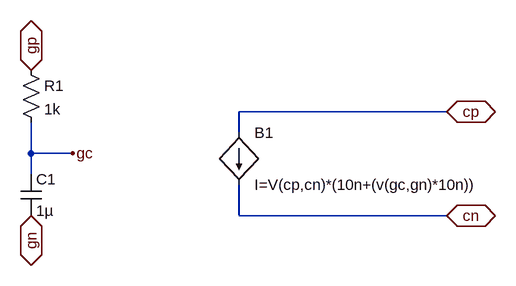
[diagram p0: schematic Projet2.asc]
Projet2.asc, the LTspice schematic file:
Version 4
SHEET 1 880 680
WIRE 304 48 -16 48
WIRE -16 80 -16 48
WIRE -336 112 -336 64
WIRE -272 112 -336 112
WIRE -336 144 -336 112
WIRE -16 208 -16 160
WIRE 304 208 -16 208
FLAG 304 48 cp
IOPIN 304 48 BiDir
FLAG 304 208 cn
IOPIN 304 208 BiDir
FLAG -336 -16 gp
IOPIN -336 -16 BiDir
FLAG -336 208 gn
IOPIN -336 208 BiDir
FLAG -272 112 gc
SYMBOL bi -16 80 R0
SYMATTR InstName B1
SYMATTR Value I=V(cp,cn)*(10n+(v(gc,gn)*10n))
SYMBOL res -352 -32 R0
SYMATTR InstName R1
SYMATTR Value 1k
SYMBOL cap -352 144 R0
SYMATTR InstName C1
SYMATTR Value 1µ

The netlist it stands for:
* Projet2.asc
B1 cp cn I=V(cp,cn)*(10n+(v(gc,gn)*10n))
R1 gp gc 1k
C1 gc gn 1µ
.backanno
.end